# EAGLE design SparkFun_RFM97CW_Breakout (EAGLE 9.6.2)
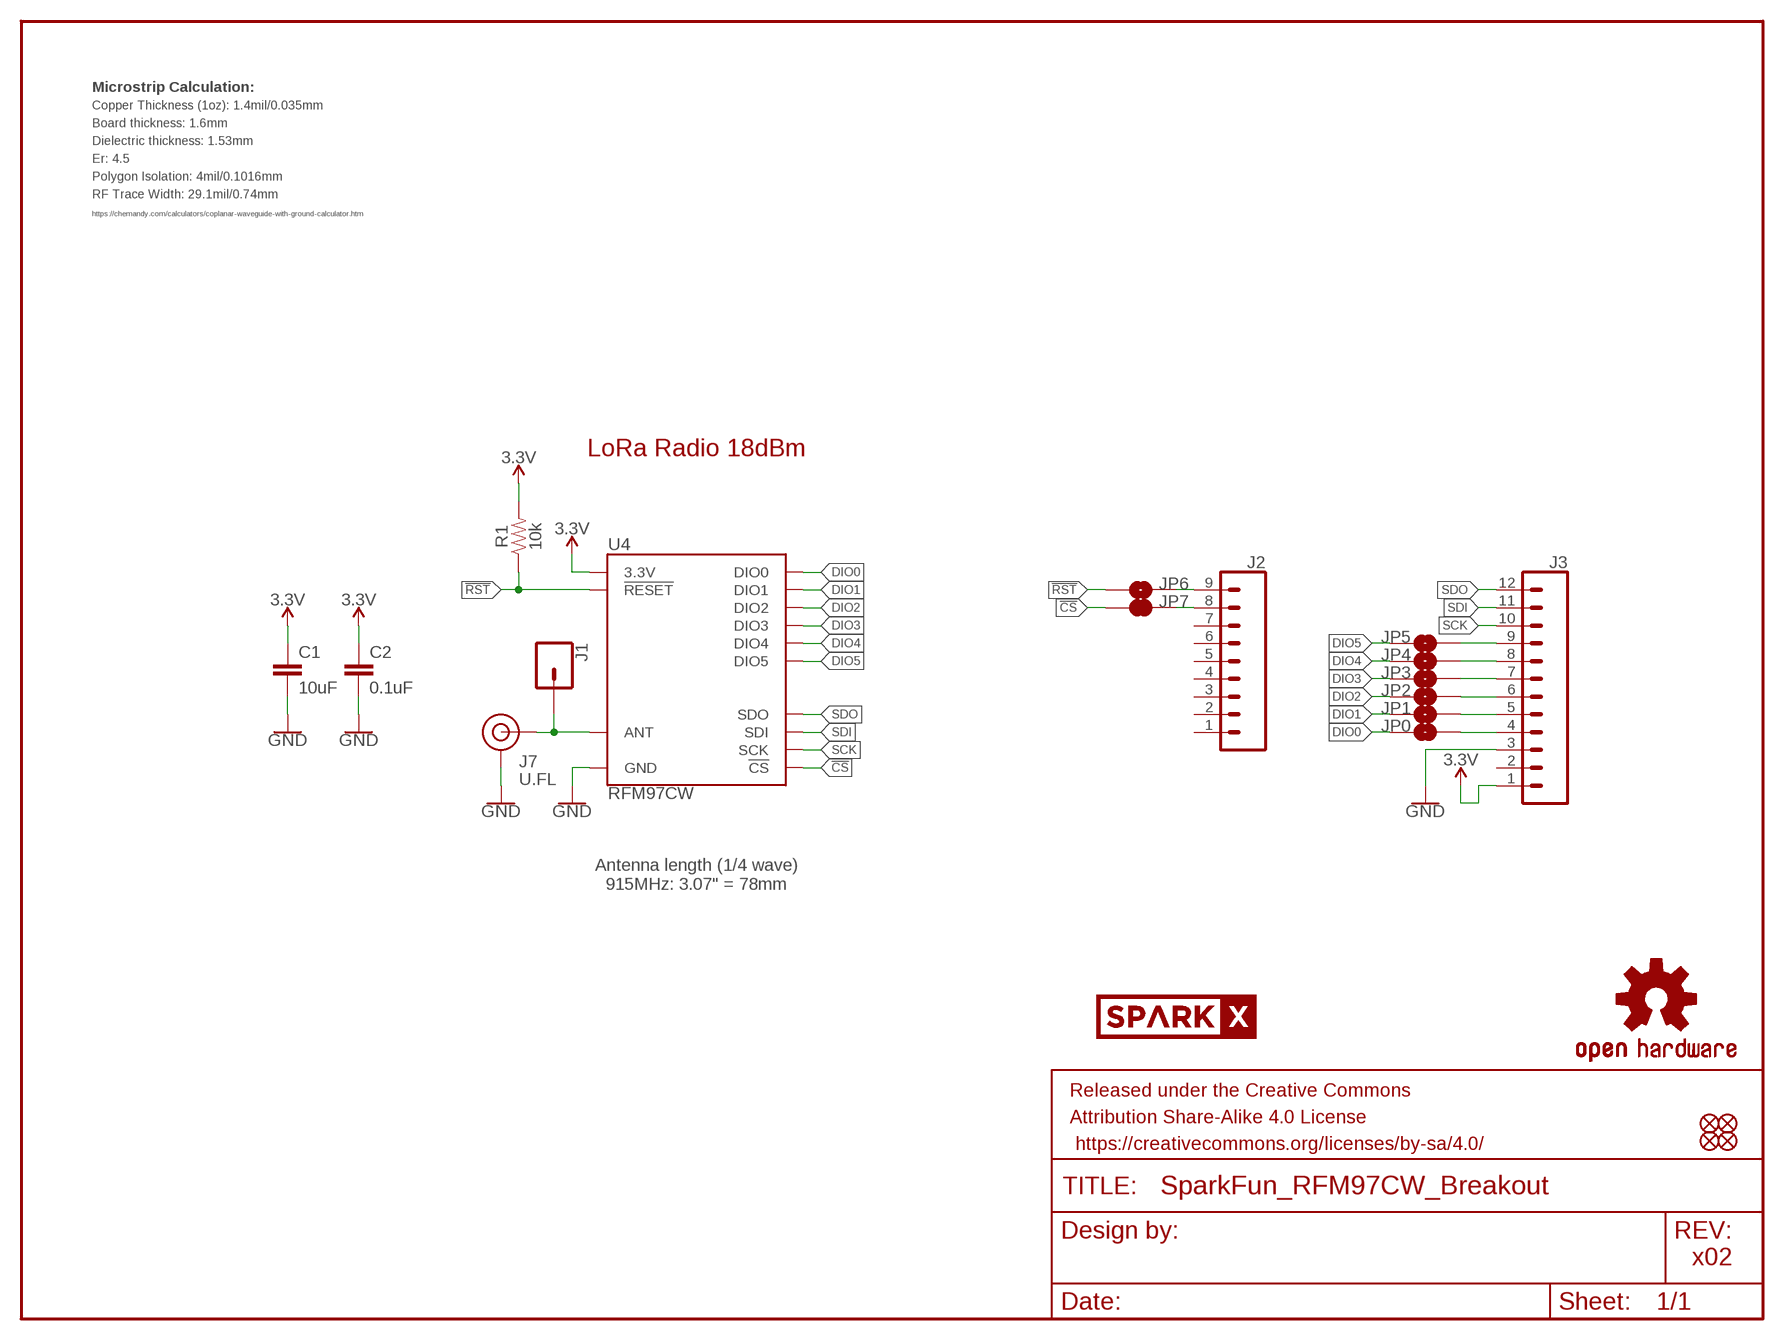
[diagram p0: schematic, sheet 1]

## Parts
C1  10uF  10UF-0603-6.3V-20%  [0603]
C2  0.1uF  0.1UF-0603-25V-(+80/-20%)  [0603]
FID1  FIDUCIAL1X2  [FIDUCIAL-1X2]
FID2  FIDUCIAL1X2  [FIDUCIAL-1X2]
FID3  FIDUCIAL1X2  [FIDUCIAL-1X2]
FID4  FIDUCIAL1X2  [FIDUCIAL-1X2]
FRAME1  FRAME-LETTER  [CREATIVE_COMMONS]
J1  CONN_01PTH_NO_SILK_YES_STOP  [1X01_NO_SILK]
J2  CONN_09NO_SILK  [1X09_NO_SILK]
J3  CONN_12NO_SILK  [1X12_NO_SILK]
J7  U.FL  U.FL2PIN  [U.FL]
JP0  JUMPER-SMT_2_NO_NO-SILK  [SMT-JUMPER_2_NO_NO-SILK]
JP1  JUMPER-SMT_2_NO_NO-SILK  [SMT-JUMPER_2_NO_NO-SILK]
JP2  JUMPER-SMT_2_NO_NO-SILK  [SMT-JUMPER_2_NO_NO-SILK]
JP3  JUMPER-SMT_2_NO_NO-SILK  [SMT-JUMPER_2_NO_NO-SILK]
JP4  JUMPER-SMT_2_NO_NO-SILK  [SMT-JUMPER_2_NO_NO-SILK]
JP5  JUMPER-SMT_2_NO_NO-SILK  [SMT-JUMPER_2_NO_NO-SILK]
JP6  JUMPER-SMT_2_NO_NO-SILK  [SMT-JUMPER_2_NO_NO-SILK]
JP7  JUMPER-SMT_2_NC_TRACE_NO-SILK  [SMT-JUMPER_2_NC_TRACE_NO-SILK]
LOGO2  OSHW-LOGOS  [OSHW-LOGO-S]
R1  10k  10KOHM-0603-1/10W-1%  [0603]
U4  RFM97CW  RFM9XRFM97  [RFM97]
U$22  SPARKX-LOGO5  [SPARKX-LARGE]

## Nets
3.3V: C1.1 C2.1 J3.1 R1.2 U4.3V3(3.3V)
!CS!: JP7.1 U4.!CS!
!RST!: JP6.1 R1.1 U4.!RST(!RESET)
ANT: J1.1 J7.FEED(SIGNAL) U4.ANT
DIO0: JP0.1 U4.DIO0
DIO1: JP1.1 U4.DIO1
DIO2: JP2.1 U4.DIO2
DIO3: JP3.1 U4.DIO3
DIO4: JP4.1 U4.DIO4
DIO5: JP5.1 U4.DIO5
GND: C1.2 C2.2 J3.3 J7.1(GND) J7.2(GND) U4.GND U4.GND@1(GND) U4.GND@2(GND)
N$1: J3.6 JP2.2
N$2: J2.9 JP6.2
N$3: J2.8 JP7.2
N$4: J3.5 JP1.2
N$5: J3.4 JP0.2
N$6: J3.7 JP3.2
N$7: J3.8 JP4.2
N$8: J3.9 JP5.2
SCK: J3.10 U4.SCK
SDI: J3.11 U4.SDI
SDO: J3.12 U4.SDO
Unconnected: J2.1 J2.2 J2.3 J2.4 J2.5 J2.6 J2.7 J3.2

## Notes on the sheet
- Microstrip Calculation:
- Copper Thickness (1oz): 1.4mil/0.035mm
- Board thickness: 1.6mm
- Dielectric thickness: 1.53mm
- Er: 4.5
- Polygon Isolation: 4mil/0.1016mm
- RF Trace Width: 29.1mil/0.74mm
- https://chemandy.com/calculators/coplanar-waveguide-with-ground-calculator.htm
- LoRa Radio 18dBm
- Antenna length (1/4 wave)
  915MHz: 3.07" = 78mm
- x02

## Library data of the parts
C1 = SparkFun-Capacitors:10UF: 10.0µF ceramic capacitors A capacitor is a passive two-terminal electrical component used to store electrical energy temporarily in an electric field.; PROD_ID: CAP-11015
C2 = SparkFun-Capacitors:0.1UF: 0.1µF ceramic capacitors A capacitor is a passive two-terminal electrical component used to store electrical energy temporarily in an electric field.; PROD_ID: CAP-00810
FID1-FID4 = SparkFun-Aesthetics:FIDUCIAL: Fiducial Alignment Points Point-of-reference for pick-and-place machines and other optical instruments.
FRAME1 = SparkFun-Aesthetics:FRAME-LETTER: Schematic Frame - Letter Standard 8.5x11 US Letter frame
J1 = SparkFun-Connectors:CONN_01: Single connection point. Often used as Generic Header-pin footprint for 0.1 inch spaced/style header connections On any of the 0.1 inch spaced packages, you can populate with these: Break Away Headers - Straight <https://www.sparkfun.com/products/116> (PRT-00116) Break Away Male Headers - Right Angle <https://www.sparkfun.com/products/553> (PRT-00553) Female Headers <https://www.sparkfun.com/products/115> (PRT-00115) Break Away Headers - Machine Pin <https://www.sparkfun.com/products/117> (PRT-00117) Break Away Female Headers - Swiss Machine Pin <https://www.sparkfun.com/products/743> (PRT-00743) This device is also useful as a general connection point to wire up your design to another part of your project. Our various solder wires solder well into these plated through hole pads. Hook-Up Wire - Assortment (Stranded, 22 AWG) <https://www.sparkfun.com/products/11375> (PRT-11375) Hook-Up Wire - Assortment (Solid Core, 22 AWG) <https://www.sparkfun.com/products/11367> (PRT-11367) View the entire wire category on our website here <https://www.sparkfun.com/categories/141> Special notes: SMTSO-256-ET is a "flush mount" nut for a 4-40 screw. We mostly use this on specialty testbeds; it is a nice way to connect hardware to your PCB at an adjustable hieght. Also note, the SNAP packages are for using a snappable style connector. We sell a baggie of snaps and they are also used on two LilyPad designs: Snap Assortment - 30 pack (male and female) <https://www.sparkfun.com/products/11347> (DEV-11347) LilyPad Arduino SimpleSnap <https://www.sparkfun.com/products/10941> (DEV-10941) LilyPad SimpleSnap Protoboard <https://www.sparkfun.com/products/10940> (DEV-10940)
J2 = SparkFun-Connectors:CONN_09: Multi connection point. Often used as Generic Header-pin footprint for 0.1 inch spaced/style header connections On any of the 0.1 inch spaced packages, you can populate with these: Break Away Headers - Straight <https://www.sparkfun.com/products/116> (PRT-00116) Break Away Male Headers - Right Angle <https://www.sparkfun.com/products/553> (PRT-00553) Female Headers <https://www.sparkfun.com/products/115> (PRT-00115) Break Away Headers - Machine Pin <https://www.sparkfun.com/products/117> (PRT-00117) Break Away Female Headers - Swiss Machine Pin <https://www.sparkfun.com/products/743> (PRT-00743) For SCREWTERMINALS and SPRING TERMINALS visit here: Screw Terimnals on SparkFun.com <https://www.sparkfun.com/search/results?term=Screw+Terminals> (5mm/3.5mm/2.54mm spacing) This device is also useful as a general connection point to wire up your design to another part of your project. Our various solder wires solder well into these plated through hole pads. Hook-Up Wire - Assortment (Stranded, 22 AWG) <https://www.sparkfun.com/products/11375> (PRT-11375) Hook-Up Wire - Assortment (Solid Core, 22 AWG) <https://www.sparkfun.com/products/11367> (PRT-11367) View the entire wire category on our website here <https://www.sparkfun.com/categories/141> Special notes: Molex polarized connector foot print use with SKU : PRT-08231 with associated crimp pins and housings. 1MM SMD Version SKU: PRT-10208 NOTES ON THE VARIANTS LOCK and LOCK_LONGPADS... This footprint was designed to help hold the alignment of a through-hole component (i.e. 6-pin header) while soldering it into place. You may notice that each hole has been shifted either up or down by 0.005 of an inch from it's more standard position (which is a perfectly straight line). This slight alteration caused the pins (the squares in the middle) to touch the edges of the holes. Because they are alternating, it causes a "brace" to hold the component in place. 0.005 has proven to be the perfect amount of "off-center" position when using our standard breakaway headers. Although looks a little odd when you look at the bare footprint, once you have a header in there, the alteration is very hard to notice. Also,if you push a header all the way into place, it is covered up entirely on the bottom side.
J3 = SparkFun-Connectors:CONN_12: Multi connection point. Often used as Generic Header-pin footprint for 0.1 inch spaced/style header connections On any of the 0.1 inch spaced packages, you can populate with these: Break Away Headers - Straight <https://www.sparkfun.com/products/116> (PRT-00116) Break Away Male Headers - Right Angle <https://www.sparkfun.com/products/553> (PRT-00553) Female Headers <https://www.sparkfun.com/products/115> (PRT-00115) Break Away Headers - Machine Pin <https://www.sparkfun.com/products/117> (PRT-00117) Break Away Female Headers - Swiss Machine Pin <https://www.sparkfun.com/products/743> (PRT-00743) For SCREWTERMINALS and SPRING TERMINALS visit here: Screw Terimnals on SparkFun.com <https://www.sparkfun.com/search/results?term=Screw+Terminals> (5mm/3.5mm/2.54mm spacing) This device is also useful as a general connection point to wire up your design to another part of your project. Our various solder wires solder well into these plated through hole pads. Hook-Up Wire - Assortment (Stranded, 22 AWG) <https://www.sparkfun.com/products/11375> (PRT-11375) Hook-Up Wire - Assortment (Solid Core, 22 AWG) <https://www.sparkfun.com/products/11367> (PRT-11367) View the entire wire category on our website here <https://www.sparkfun.com/categories/141> Special notes: Molex polarized connector foot print use with SKU : PRT-08231 with associated crimp pins and housings. 1MM SMD Version SKU: PRT-10208 NOTES ON THE VARIANTS LOCK and LOCK_LONGPADS... This footprint was designed to help hold the alignment of a through-hole component (i.e. 6-pin header) while soldering it into place. You may notice that each hole has been shifted either up or down by 0.005 of an inch from it's more standard position (which is a perfectly straight line). This slight alteration caused the pins (the squares in the middle) to touch the edges of the holes. Because they are alternating, it causes a "brace" to hold the component in place. 0.005 has proven to be the perfect amount of "off-center" position when using our standard breakaway headers. Although looks a little odd when you look at the bare footprint, once you have a header in there, the alteration is very hard to notice. Also,if you push a header all the way into place, it is covered up entirely on the bottom side.
J7 = SparkFun-Connectors:U.FL2PIN: SMD Antenna Connector - U.FL 2mm height, 3.0mm x 3.0mm receptacle size. SparkFun Products: SparkFun WiFi Shield - ESP8266 <https://www.sparkfun.com/products/13287> SparkFun ESP8266 Thing <https://www.sparkfun.com/products/13231> SparkFun MiniGen - Pro Mini Signal Generator Shield <https://www.sparkfun.com/products/11420>; PROD_ID: CONN-09193; SF_ID: WRL-09144
JP0 JP1-JP6 = SparkFun-Jumpers:JUMPER-SMT_2_NO: Normally open jumper This jumper has two pads in close proximity to each other. Apply solder to close the connection. Round pads are easier to solder for beginners, but are a lot larger. SparkFun Product that uses the round pads: SparkFun EL Sequencer <https://www.sparkfun.com/products/12781>
JP7 = SparkFun-Jumpers:JUMPER-SMT_2_NC_TRACE: Normally closed trace jumper This jumper has a trace between two pads so it's normally closed (NC). Use a razor knife to open the connection. For best results follow the IPC guidelines for cutting traces: Cutout at least 0.063 mm (0.005 in). Remove all loose material to clean up the cut area. Seal the cut with an approved epoxy. Reapply solder to reclose the connection.
LOGO2 = SparkFun-Aesthetics:OSHW-LOGO: Open-Source Hardware (OSHW) Logo This logo indicates the piece of hardware it is found on incorporates a OSHW license and/or adheres to the definition of open source hardware found here: http://freedomdefined.org/OSHW
R1 = SparkFun-Resistors:10KOHM: 10kΩ resistor A resistor is a passive two-terminal electrical component that implements electrical resistance as a circuit element. Resistors act to reduce current flow, and, at the same time, act to lower voltage levels within circuits. - Wikipedia; PROD_ID: RES-00824
U4 = SparkFun-RF:RFM9X: RFM95/96/97/98 The RFM95/96/97/98(W) transceivers feature the LoRaTM long range modem that provides ultra-long range spread spectrum communication and high interference immunity whilst minimising current consumption. These devices also support high performance (G)FSK modes for systems including WMBus, IEEE802.15.4g. The RFM95/96/97/98(W) deliver exceptional phase noise, selectivity, receiver linearity and IIP3 for significantly lower current consumption than competing devices Datasheet <http://www.hoperf.com/upload/rf/RFM95_96_97_98W.pdf>; PROD_ID: IC-15944
U$22 = SparkX:SPARKX-LOGO

## Board
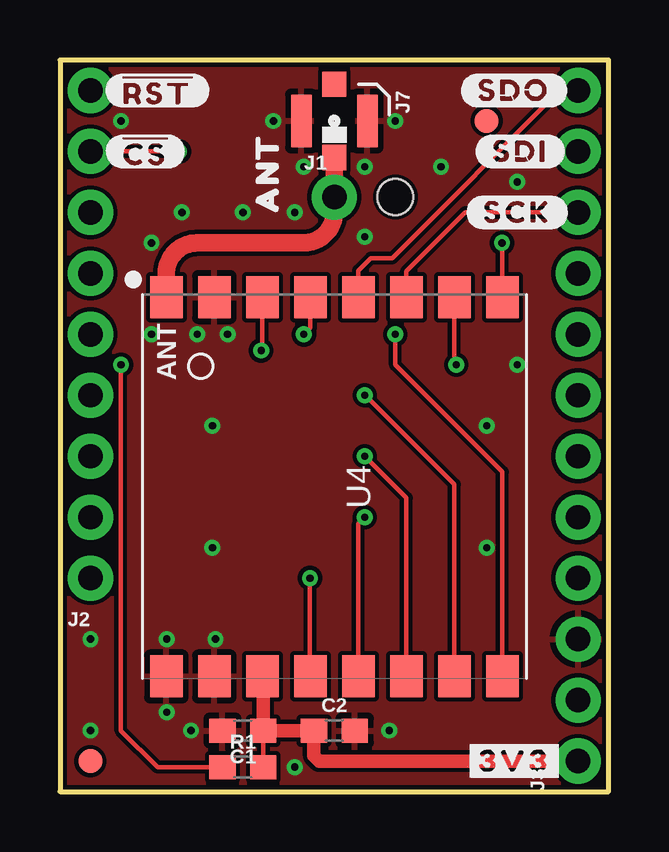
[diagram p1: board, top side]
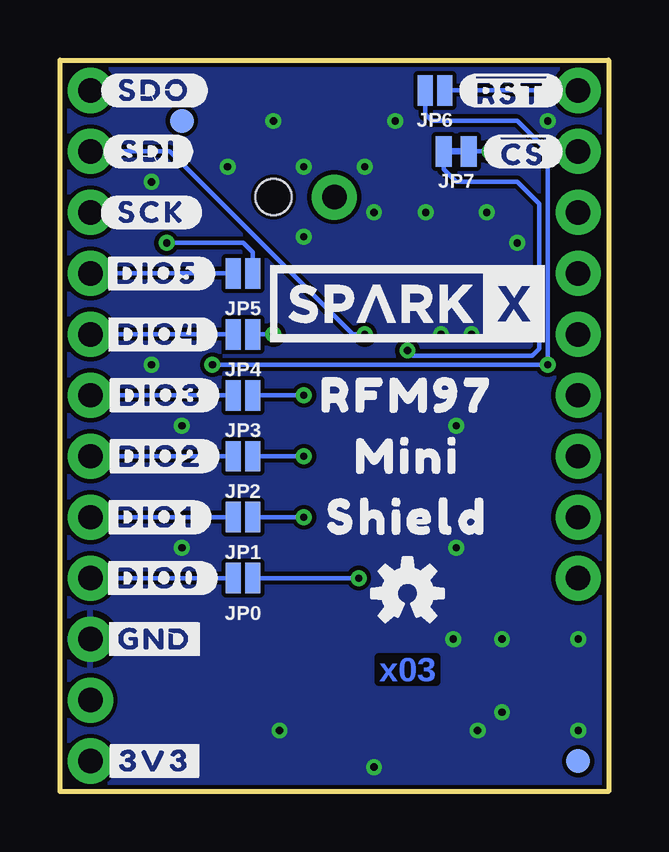
[diagram p2: board, bottom side, seen from below]

Size 22.86 x 30.48 mm. Coordinates in mm from the lower left corner, seen from the top.
Outline: 0,0 22.86,0 22.86,30.48 0,30.48 0,0
Copper layers (1*16): Top 0.035mm / dielectric 1.5mm / Bottom 0.035mm
Design rules "SparkFun-2-Layer-General-JLCPCB": minimum track width 7mil, minimum drill 0.3mm, track to track 7mil, track to pad 7mil, pad to pad 7mil, via to via 7mil, smd to smd 7mil, copper to edge 7mil, drill to drill 7mil, minimum pad ring 7mil, minimum via ring 7mil, stop-mask expansion 3mil, vias tented up to drill 25mil, thermal gap 10mil
Holes 1.5 mm at 13.97,24.77
tRestrict: area 10.7,27.1 to 12.2,28.8

### Footprints (pad centres in the part's own frame; a part is rotated, then mirrored left to right if it is on the bottom)
0603 = smd 1.1 x 1: 1 -0.85,0; 2 0.85,0
FIDUCIAL-1X2 = smd 1 x 1: 1 0,0
1X01_NO_SILK = drill 1.016 pad 1.88: 1 0,0
1X09_NO_SILK = drill 1.016 pad 1.88: 1 0,0; 2 2.54,0; 3 5.08,0; 4 7.62,0; 5 10.16,0; 6 12.7,0; 7 15.24,0; 8 17.78,0; 9 20.32,0
1X12_NO_SILK = drill 1.016 pad 1.88: 1 0,0; 2 2.54,0; 3 5.08,0; 4 7.62,0; 5 10.16,0; 6 12.7,0; 7 15.24,0; 8 17.78,0; 9 20.32,0; 10 22.86,0; 11 25.4,0; 12 27.94,0
U.FL = smd 2.2 x 0.85: 1 0,1.375; 2 0,-1.375 | smd 1.05 x 1: FEED 1.525,0; NC -1.525,0
SMT-JUMPER_2_NO_NO-SILK = smd 0.635 x 1.27: 1 -0.406,0; 2 0.406,0
SMT-JUMPER_2_NC_TRACE_NO-SILK = smd 0.66 x 1.27: 1 -0.521,0; 2 0.521,0
RFM97 = smd 1.75 x 1.35: 3V3 7.9,-3; !CS! -7.9,-3; !RST -7.9,5; ANT -7.9,-7; DIO0 7.9,-1; DIO1 7.9,1; DIO2 7.9,3; DIO3 7.9,5; DIO4 7.9,7; DIO5 -7.9,7; GND -7.9,-5; GND@1 7.9,-7; GND@2 7.9,-5; SCK -7.9,3; SDI -7.9,-1; SDO -7.9,1

### Placement (x,y rotation side)
C1  7.62,2.54 180 top
C2  11.43,2.54 0 top
FID1  1.27,1.27 0 top
FID2  17.78,27.94 0 top
FID3  1.27,1.27 0 bottom
FID4  17.78,27.94 0 bottom
FRAME1  -15.24,-12.7 0 top  (outside the outline)
J1  11.43,24.77 0 top
J2  1.27,8.89 90 top
J3  21.59,1.27 90 top
J7  11.43,27.94 270 top
JP0  15.24,8.89 180 bottom
JP1  15.24,11.43 180 bottom
JP2  15.24,13.97 180 bottom
JP3  15.24,16.51 180 bottom
JP4  15.24,19.05 180 bottom
JP5  15.24,21.59 180 bottom
JP6  7.24,29.21 0 bottom
JP7  6.35,26.67 0 bottom
LOGO2  8.38,8.26 0 bottom
R1  7.62,1.02 0 top
U4  11.43,12.7 270 top
U$1  [ANT0]  8.64,25.78 90 top
U$2  [##CS##2]  3.56,26.67 0 bottom
U$3  [#SDO#0]  18.92,29.21 0 top
U$4  [#SDI#1]  19.18,26.67 0 top
U$5  [#SCK#0]  19.05,24.13 0 top
U$6  [#SDI#1]  19.18,26.67 0 bottom
U$7  [#SDO#0]  18.92,29.21 0 bottom
U$8  [#3V3#0]  18.92,1.27 0 top
U$9  [#3V3#0]  18.92,1.27 0 bottom
U$10  [#GND#1]  18.92,6.35 0 bottom
U$11  [MINI0]  8.38,13.97 0 bottom
U$12  [#SCK#0]  19.05,24.13 0 bottom
U$13  [##RST##0]  4.06,29.21 0 top
U$17  [##RST##0]  4.06,29.21 0 bottom
U$19  [RFM970]  8.38,16.51 0 bottom
U$20  [SHIELD2]  8.38,11.43 0 bottom
U$21  [##CS##2]  3.56,26.67 0 top
U$22  8.38,20.32 0 bottom
U$23  [#DIO0#0]  18.73,8.89 0 bottom
U$24  [#DIO1#0]  18.86,11.43 0 bottom
U$25  [#DIO2#0]  18.67,13.97 0 bottom
U$26  [#DIO3#0]  18.67,16.51 0 bottom
U$27  [#DIO4#0]  18.73,19.05 0 bottom
U$28  [#DIO5#0]  18.8,21.59 0 bottom

### Tracks (layer width: path | path; a pad name or v marks a point on that pad's centre or on a via)
3.3V
  Top 0.178: C1.1 R1.2
  Top 0.559: J3.1 10.79,1.27 10.58,1.49 C2.1 C1.1 8.47,4.76 U4.3V3
!CS!  (via drill 0.3)
  Top 0.178: v8.38,18.38 8.43,18.43 U4.!CS!
  Bottom 0.178: JP7.1 6.87,25.92 6.35,25.4 3.81,25.4 2.9,24.49 2.9,18.44 3.17,18.16 8.17,18.16 v8.38,18.38
!RST!  (via drill 0.3)
  Top 0.178: R1.1 4.06,1.02 2.54,2.54 v2.54,17.78 | v16.51,17.78 16.43,17.86 U4.!RST
  Bottom 0.178: v16.51,17.78 v2.54,17.78 2.54,26.67 3.81,27.94 7.37,27.94 7.64,28.22 JP6.1
ANT
  Top 0.739: U4.ANT 4.43,21.57 arc-90 5.71,22.86 10.16,22.86 arc90 11.43,24.13 J1.1 J7.FEED
DIO0  (via drill 0.3)
  Top 0.178: v10.41,8.89 10.41,4.82 U4.DIO0
  Bottom 0.178: v10.41,8.89 JP0.1
DIO1  (via drill 0.3)
  Top 0.178: U4.DIO1 12.43,11.16 v12.7,11.43
  Bottom 0.178: v12.7,11.43 JP1.1
DIO2  (via drill 0.3)
  Top 0.178: U4.DIO2 14.43,12.24 v12.7,13.97
  Bottom 0.178: v12.7,13.97 JP2.1
DIO3  (via drill 0.3)
  Top 0.178: v12.7,16.51 12.72,16.51 16.43,12.8 U4.DIO3
  Bottom 0.178: v12.7,16.51 JP3.1
DIO4  (via drill 0.3)
  Top 0.178: U4.DIO4 18.43,13.32 13.97,17.78 v13.97,19.05
  Bottom 0.178: v13.97,19.05 JP4.1
DIO5  (via drill 0.3)
  Top 0.178: U4.DIO5 18.43,22.84 v18.41,22.86
  Bottom 0.178: v18.41,22.86 15.21,22.86 14.83,22.48 JP5.1
GND  (via drill 0.3)
  other vias: 6.48,6.35 4.45,6.35 4.45,3.3 5.46,2.54 13.72,2.54 5.71,19.05 6.99,19.05 13.97,27.94 8.89,27.94 10.16,26.04 12.7,26.04 5.08,24.13 3.81,22.86 7.62,24.13 9.78,24.13 12.7,23.11 3.81,19.05 1.27,2.54 1.27,6.35 9.78,1.02 15.88,26.04 19.05,25.4 6.35,15.24 6.35,10.16 17.78,10.16 17.78,15.24 19.05,17.78 2.54,27.94
  pour Bottom (isolate 0.102): 0,30.48 22.86,30.48 22.86,0 0,0
  pour Top (isolate 0.102): 0,30.48 22.86,30.48 22.86,0 0,0
N$1
  Bottom 0.178: JP2.2 J3.6
N$2
  Bottom 0.178: J2.9 JP6.2
N$3  (via drill 0.3)
  Top 0.178: J2.8 v4.95,26.67
  Bottom 0.178: v4.95,26.67 JP7.2
N$4
  Bottom 0.178: JP1.2 J3.5
N$5
  Bottom 0.178: JP0.2 J3.4
N$6
  Bottom 0.178: JP3.2 J3.7
N$7
  Bottom 0.178: JP4.2 J3.8
N$8
  Bottom 0.178: JP5.2 J3.9
SCK
  Top 0.178: U4.SCK 14.43,21.67 16.89,24.13 J3.10
SDI  (via drill 0.3)
  Top 0.178: U4.SDI 10.43,19.32 v10.16,19.05
  Bottom 0.178: v10.16,19.05 10.67,19.05 18.29,26.67 J3.11
SDO
  Top 0.178: J3.12 20.83,29.21 13.84,22.23 12.95,22.23 12.43,21.7 U4.SDO

### Text on the board
Bottom: x03